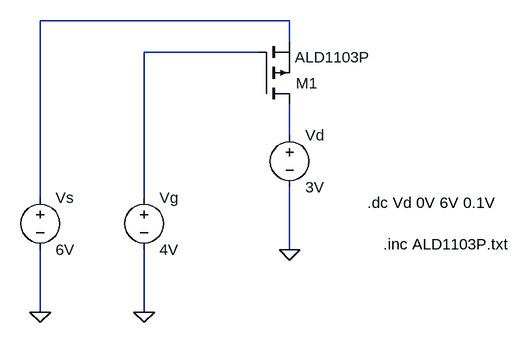
[diagram p0: schematic Exp2.asc]
Exp2.asc, the LTspice schematic file:
Version 4.1
SHEET 1 880 680
WIRE 496 -144 112 -144
WIRE 496 -112 496 -144
WIRE 448 -96 272 -96
WIRE 496 32 496 -16
WIRE 112 128 112 -144
WIRE 272 128 272 -96
WIRE 496 208 496 112
WIRE 112 304 112 208
WIRE 272 304 272 208
FLAG 112 304 0
FLAG 272 304 0
FLAG 496 208 0
SYMBOL voltage 112 112 R0
SYMATTR InstName Vs
SYMATTR Value 6V
SYMBOL voltage 272 112 R0
WINDOW 123 0 0 Left 0
WINDOW 39 0 0 Left 0
SYMATTR InstName Vg
SYMATTR Value 4V
SYMBOL voltage 496 16 R0
SYMATTR InstName Vd
SYMATTR Value 3V
SYMBOL pmos 448 -16 M180
WINDOW 0 58 32 Left 2
SYMATTR InstName M1
SYMATTR Value ALD1103P
TEXT 640 200 Left 2 !.inc ALD1103P.txt
TEXT 616 136 Left 2 !.dc Vd 0V 6V 0.1V

The netlist it stands for:
* Exp2.asc
Vs N001 0 6V
Vg N002 0 4V
Vd N003 0 3V
M1 N003 N002 N001 N001 ALD1103P
.model NMOS NMOS
.model PMOS PMOS
.lib standard.mos
.inc ALD1103P.txt
.dc Vd 0V 6V 0.1V
.backanno
.end